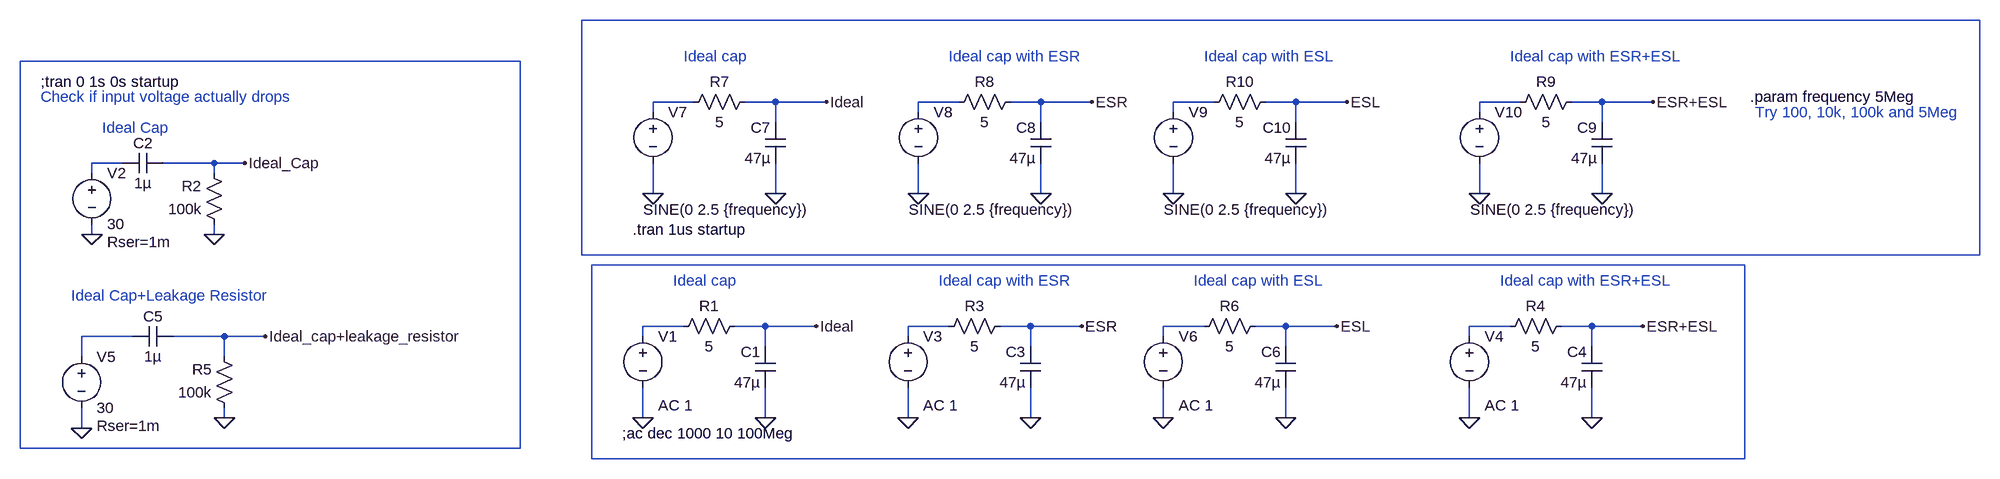
[diagram p0: schematic Capacitor_explanation.asc]
Capacitor_explanation.asc, the LTspice schematic file:
Version 4
SHEET 1 2436 680
WIRE 416 32 352 32
WIRE 544 32 496 32
WIRE 624 32 544 32
WIRE 832 32 768 32
WIRE 960 32 912 32
WIRE 1040 32 960 32
WIRE 1232 32 1168 32
WIRE 1360 32 1312 32
WIRE 1440 32 1360 32
WIRE 1712 32 1648 32
WIRE 1840 32 1792 32
WIRE 1920 32 1840 32
WIRE 352 48 352 32
WIRE 768 48 768 32
WIRE 1168 48 1168 32
WIRE 1648 48 1648 32
WIRE 544 64 544 32
WIRE 960 64 960 32
WIRE 1360 64 1360 32
WIRE 1840 64 1840 32
WIRE -480 128 -528 128
WIRE -336 128 -416 128
WIRE -288 128 -336 128
WIRE -528 144 -528 128
WIRE -336 144 -336 128
WIRE 352 176 352 128
WIRE 544 176 544 128
WIRE 768 176 768 128
WIRE 960 176 960 128
WIRE 1168 176 1168 128
WIRE 1360 176 1360 128
WIRE 1648 176 1648 128
WIRE 1840 176 1840 128
WIRE -528 240 -528 224
WIRE -336 240 -336 224
WIRE 400 384 336 384
WIRE 528 384 480 384
WIRE 608 384 528 384
WIRE 816 384 752 384
WIRE 944 384 896 384
WIRE 1024 384 944 384
WIRE 1216 384 1152 384
WIRE 1344 384 1296 384
WIRE 1424 384 1344 384
WIRE 1696 384 1632 384
WIRE 1824 384 1776 384
WIRE 1904 384 1824 384
WIRE -464 400 -544 400
WIRE -320 400 -400 400
WIRE -256 400 -320 400
WIRE 336 400 336 384
WIRE 752 400 752 384
WIRE 1152 400 1152 384
WIRE 1632 400 1632 384
WIRE 528 416 528 384
WIRE 944 416 944 384
WIRE 1344 416 1344 384
WIRE 1824 416 1824 384
WIRE -544 432 -544 400
WIRE -320 432 -320 400
WIRE -320 528 -320 512
WIRE 336 528 336 480
WIRE 528 528 528 480
WIRE 752 528 752 480
WIRE 944 528 944 480
WIRE 1152 528 1152 480
WIRE 1344 528 1344 480
WIRE 1632 528 1632 480
WIRE 1824 528 1824 480
WIRE -544 544 -544 512
FLAG 528 528 0
FLAG 336 528 0
FLAG -528 240 0
FLAG -336 240 0
FLAG 608 384 Ideal
FLAG 944 528 0
FLAG 752 528 0
FLAG 1024 384 ESR
FLAG 1824 528 0
FLAG 1632 528 0
FLAG 1904 384 ESR+ESL
FLAG -288 128 Ideal_Cap
FLAG -544 544 0
FLAG -320 528 0
FLAG -256 400 Ideal_cap+leakage_resistor
FLAG 1344 528 0
FLAG 1152 528 0
FLAG 1424 384 ESL
FLAG 544 176 0
FLAG 352 176 0
FLAG 624 32 Ideal
FLAG 960 176 0
FLAG 768 176 0
FLAG 1040 32 ESR
FLAG 1840 176 0
FLAG 1648 176 0
FLAG 1920 32 ESR+ESL
FLAG 1360 176 0
FLAG 1168 176 0
FLAG 1440 32 ESL
SYMBOL voltage 336 384 R0
WINDOW 123 24 124 Left 2
WINDOW 39 0 0 Left 0
SYMATTR Value2 AC 1
SYMATTR InstName V1
SYMATTR Value ""
SYMBOL cap 544 480 R180
WINDOW 0 24 56 Left 2
WINDOW 3 24 8 Left 2
SYMATTR InstName C1
SYMATTR Value 47µ
SYMBOL res 496 368 R90
WINDOW 0 0 56 VBottom 2
WINDOW 3 32 56 VTop 2
SYMATTR InstName R1
SYMATTR Value 5
SYMBOL cap -416 144 M270
WINDOW 0 32 32 VTop 2
WINDOW 3 0 32 VBottom 2
SYMATTR InstName C2
SYMATTR Value 1µ
SYMBOL res -320 240 R180
WINDOW 0 36 76 Left 2
WINDOW 3 36 40 Left 2
SYMATTR InstName R2
SYMATTR Value 100k
SYMBOL voltage 752 384 R0
WINDOW 123 24 124 Left 2
WINDOW 39 0 0 Left 0
SYMATTR Value2 AC 1
SYMATTR InstName V3
SYMATTR Value ""
SYMBOL cap 960 480 R180
WINDOW 0 24 56 Left 2
WINDOW 3 24 8 Left 2
SYMATTR InstName C3
SYMATTR Value 47µ
SYMATTR SpiceLine Rser=0.1
SYMBOL res 912 368 R90
WINDOW 0 0 56 VBottom 2
WINDOW 3 32 56 VTop 2
SYMATTR InstName R3
SYMATTR Value 5
SYMBOL voltage 1632 384 R0
WINDOW 123 24 124 Left 2
WINDOW 39 0 0 Left 0
SYMATTR Value2 AC 1
SYMATTR InstName V4
SYMATTR Value ""
SYMBOL cap 1840 480 R180
WINDOW 0 24 56 Left 2
WINDOW 3 24 8 Left 2
SYMATTR InstName C4
SYMATTR Value 47µ
SYMATTR SpiceLine Rser=0.1 Lser=10n
SYMBOL res 1792 368 R90
WINDOW 0 0 56 VBottom 2
WINDOW 3 32 56 VTop 2
SYMATTR InstName R4
SYMATTR Value 5
SYMBOL voltage -528 128 R0
WINDOW 123 0 0 Left 0
WINDOW 39 24 124 Left 2
SYMATTR InstName V2
SYMATTR Value 30
SYMATTR SpiceLine Rser=1m
SYMBOL cap -464 416 R270
WINDOW 0 32 32 VTop 2
WINDOW 3 0 32 VBottom 2
SYMATTR InstName C5
SYMATTR Value 1µ
SYMATTR SpiceLine Rpar=1Meg
SYMBOL res -304 528 R180
WINDOW 0 36 76 Left 2
WINDOW 3 36 40 Left 2
SYMATTR InstName R5
SYMATTR Value 100k
SYMBOL voltage -544 416 R0
WINDOW 123 0 0 Left 0
WINDOW 39 24 124 Left 2
SYMATTR InstName V5
SYMATTR Value 30
SYMATTR SpiceLine Rser=1m
SYMBOL voltage 1152 384 R0
WINDOW 123 24 124 Left 2
WINDOW 39 0 0 Left 0
SYMATTR Value2 AC 1
SYMATTR InstName V6
SYMATTR Value ""
SYMBOL cap 1360 480 R180
WINDOW 0 24 56 Left 2
WINDOW 3 24 8 Left 2
SYMATTR InstName C6
SYMATTR Value 47µ
SYMATTR SpiceLine Lser=10n
SYMBOL res 1312 368 R90
WINDOW 0 0 56 VBottom 2
WINDOW 3 32 56 VTop 2
SYMATTR InstName R6
SYMATTR Value 5
SYMBOL voltage 352 32 R0
WINDOW 123 24 124 Left 2
WINDOW 39 0 0 Left 0
WINDOW 3 -15 169 Left 2
SYMATTR InstName V7
SYMATTR Value SINE(0 2.5 {frequency})
SYMBOL cap 560 128 R180
WINDOW 0 24 56 Left 2
WINDOW 3 24 8 Left 2
SYMATTR InstName C7
SYMATTR Value 47µ
SYMBOL res 512 16 R90
WINDOW 0 0 56 VBottom 2
WINDOW 3 32 56 VTop 2
SYMATTR InstName R7
SYMATTR Value 5
SYMBOL cap 976 128 R180
WINDOW 0 24 56 Left 2
WINDOW 3 24 8 Left 2
SYMATTR InstName C8
SYMATTR Value 47µ
SYMATTR SpiceLine Rser=0.1
SYMBOL res 928 16 R90
WINDOW 0 0 56 VBottom 2
WINDOW 3 32 56 VTop 2
SYMATTR InstName R8
SYMATTR Value 5
SYMBOL cap 1856 128 R180
WINDOW 0 24 56 Left 2
WINDOW 3 24 8 Left 2
SYMATTR InstName C9
SYMATTR Value 47µ
SYMATTR SpiceLine Rser=0.1 Lser=10n
SYMBOL res 1808 16 R90
WINDOW 0 0 56 VBottom 2
WINDOW 3 32 56 VTop 2
SYMATTR InstName R9
SYMATTR Value 5
SYMBOL cap 1376 128 R180
WINDOW 0 24 56 Left 2
WINDOW 3 24 8 Left 2
SYMATTR InstName C10
SYMATTR Value 47µ
SYMATTR SpiceLine Lser=10n
SYMBOL res 1328 16 R90
WINDOW 0 0 56 VBottom 2
WINDOW 3 32 56 VTop 2
SYMATTR InstName R10
SYMATTR Value 5
SYMBOL voltage 768 32 R0
WINDOW 123 24 124 Left 2
WINDOW 39 0 0 Left 0
WINDOW 3 -15 169 Left 2
SYMATTR InstName V8
SYMATTR Value SINE(0 2.5 {frequency})
SYMBOL voltage 1168 32 R0
WINDOW 123 24 124 Left 2
WINDOW 39 0 0 Left 0
WINDOW 3 -15 169 Left 2
SYMATTR InstName V9
SYMATTR Value SINE(0 2.5 {frequency})
SYMBOL voltage 1648 32 R0
WINDOW 123 24 124 Left 2
WINDOW 39 0 0 Left 0
WINDOW 3 -15 169 Left 2
SYMATTR InstName V10
SYMATTR Value SINE(0 2.5 {frequency})
TEXT 304 552 Left 2 !;ac dec 1000 10 100Meg
TEXT -608 0 Left 2 !;tran 0 1s 0s startup
TEXT -608 24 Left 2 ;Check if input voltage actually drops
TEXT 384 312 Left 2 ;Ideal cap
TEXT 800 312 Left 2 ;Ideal cap with ESR
TEXT 1680 312 Left 2 ;Ideal cap with ESR+ESL
TEXT -512 72 Left 2 ;Ideal Cap
TEXT -560 336 Left 2 ;Ideal Cap+Leakage Resistor
TEXT 1200 312 Left 2 ;Ideal cap with ESL
TEXT 400 -40 Left 2 ;Ideal cap
TEXT 816 -40 Left 2 ;Ideal cap with ESR
TEXT 1696 -40 Left 2 ;Ideal cap with ESR+ESL
TEXT 1216 -40 Left 2 ;Ideal cap with ESL
TEXT 320 232 Left 2 !.tran 1us startup
TEXT 2072 24 Left 2 !.param frequency 5Meg
TEXT 2080 48 Left 2 ;Try 100, 10k, 100k and 5Meg
RECTANGLE Normal -640 -32 144 576
RECTANGLE Normal 2064 592 256 288
RECTANGLE Normal 2432 272 240 -96

The netlist it stands for:
* Capacitor_explanation.asc
V1 N006 0 AC 1
C1 0 Ideal 47µ
R1 Ideal N006 5
C2 Ideal_Cap N005 1µ
R2 0 Ideal_Cap 100k
V3 N007 0 AC 1
C3 0 ESR 47µ Rser=0.1
R3 ESR N007 5
V4 N009 0 AC 1
C4 0 ESR+ESL 47µ Rser=0.1 Lser=10n
R4 ESR+ESL N009 5
V2 N005 0 30 Rser=1m
C5 N010 Ideal_cap+leakage_resistor 1µ Rpar=1Meg
R5 0 Ideal_cap+leakage_resistor 100k
V5 N010 0 30 Rser=1m
V6 N008 0 AC 1
C6 0 ESL 47µ Lser=10n
R6 ESL N008 5
V7 N001 0 SINE(0 2.5 {frequency})
C7 0 Ideal 47µ
R7 Ideal N001 5
C8 0 ESR 47µ Rser=0.1
R8 ESR N002 5
C9 0 ESR+ESL 47µ Rser=0.1 Lser=10n
R9 ESR+ESL N004 5
C10 0 ESL 47µ Lser=10n
R10 ESL N003 5
V8 N002 0 SINE(0 2.5 {frequency})
V9 N003 0 SINE(0 2.5 {frequency})
V10 N004 0 SINE(0 2.5 {frequency})
;ac dec 1000 10 100Meg
;tran 0 1s 0s startup
* Check if input voltage actually drops
* Ideal cap
* Ideal cap with ESR
* Ideal cap with ESR+ESL
* Ideal Cap
* Ideal Cap+Leakage Resistor
* Ideal cap with ESL
* Ideal cap
* Ideal cap with ESR
* Ideal cap with ESR+ESL
* Ideal cap with ESL
.tran 1us startup
.param frequency 5Meg
* Try 100, 10k, 100k and 5Meg
.backanno
.end

* Results of the author's LTspice run, read from the files saved beside the schematic
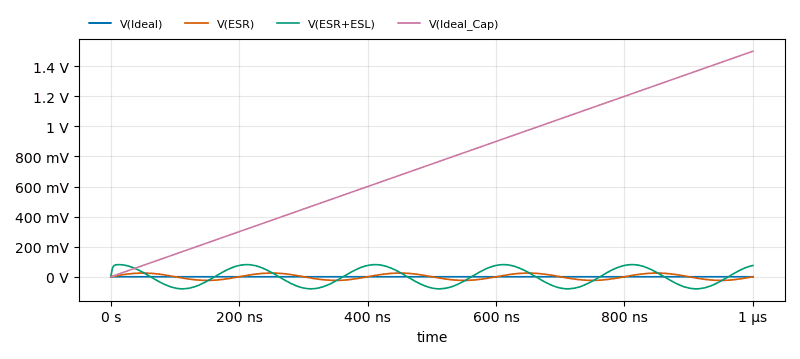
[diagram p1: Transient Analysis of Capacitor_explanation.asc, plotted from the saved traces]
* Transient Analysis, 1 run:
*   V(Ideal): min -718.9 nV, max 338.4 µV, average 168.8 µV, rms 207 µV, last -718.9 nV
*   V(ESR): min -24.34 mV, max 24.66 mV, average 164 µV, rms 17.32 mV, last -677.4 nV
*   V(ESR+ESL): min -80.36 mV, max 80.68 mV, average 75.67 µV, rms 56.78 mV, last 75.24 mV
*   V(Ideal_Cap): min 0 V, max 1.5 V, average 750 mV, rms 866 mV, last 1.5 V